# Altium schematic sheet TLV62569.SchDoc
size A3; SheetNumber: 6; SheetTotal: 7
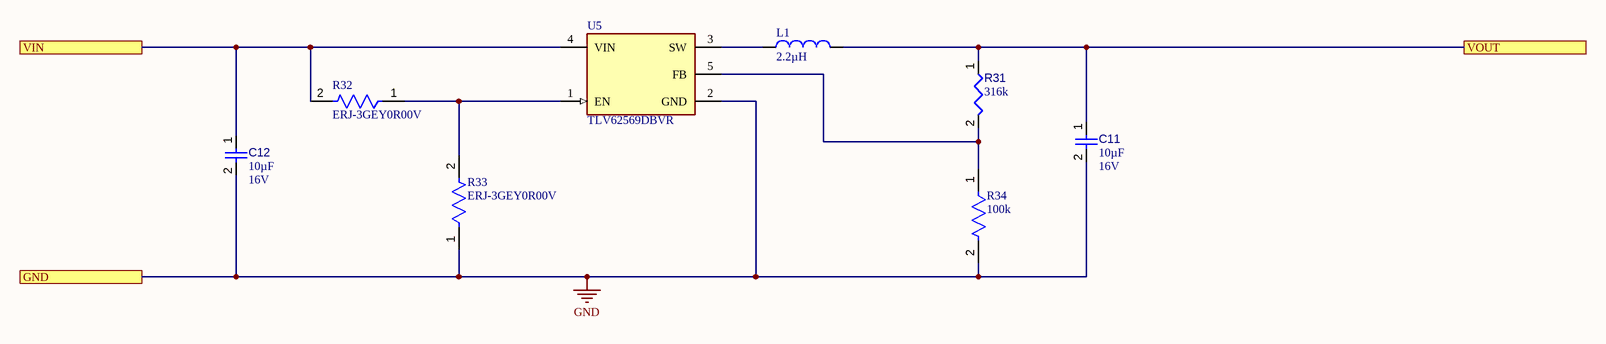
[diagram p0: TLV62569.SchDoc]

## Parts
C11  value 10µF  Voltage Rating: 16V  [CAPC1608X09N]  (hidden comment: CL10A106MO8NQNC)
C12  value 10µF  Voltage Rating: 16V  [CAPC1608X09N]  (hidden comment: CL10A106MO8NQNC)
L1  value 2.2µH  [INDC5050X40N]  (hidden comment: CMLW5040S2R2MST)
R31  value 316k  [RESC0402(1005)_L]  (hidden comment: Resistor 316K +/-1 % 0402 63 mW)
R32  ERJ-3GEY0R00V  [FP-ERJ-3GEY0R00V-MFG]
R33  ERJ-3GEY0R00V  [FP-ERJ-3GEY0R00V-MFG]
R34  Resistance: 100k  [FP-CRCW0402-e3-IPC_C]  (hidden comment: CRCW0402100KFKED)
U5  TLV62569DBVR  [FP-DBV0005A-IPC_B]

## Ports
GND, VIN, VOUT

## Nets
GND: C11.2 C12.2 R33.1 R34.2 U5.2(GND) ; port GND
VIN: C12.1 R32.2 U5.4(VIN) ; port VIN
VOUT: C11.1 L1.2 R31.1 ; port VOUT
NetL1_1: L1.1 U5.3(SW)
NetR31_2: R31.2 R34.1 U5.5(FB)
NetR32_1: R32.1 R33.2 U5.1(EN)

## Notes on the sheet
- Sheet Title
- PCB Project Name
- Modified
- Sheet
- of

## Library data of the parts
C11 C12 = CMP-001-00088-2: Ceramic Capacitor, Multilayer, Ceramic, 16V, 20% +Tol, 20% -Tol, X5R, 15% TC, 10uF, Surface Mount, 0603; Manufacturer 1: Samsung; Manufacturer Lifecycle 1: Unknown; RoHS Compliant: Yes; Min Operating Temperature: -55°C; Manufacturer Part Number 1: CL10A106MO8NQNC; Case/Package: 0603; Supplier 1: LCSC; Supplier Unit Price 1: .007; Capacitor Type: Ceramic; Supplier Part Number 1: C92487; Max Operating Temperature: 85°C; Pins: 2; Mounting Technology: Surface Mount
L1 = CMP-006-00022-1: Shielded wirewound inductor, 2.2uH, 20%, 3.95A, 17 mohm DCR; Manufacturer 1: Cybermax; Manufacturer Lifecycle 1: Unknown; Supplier Part Number 1: CMLW5040S2R2MST; Case/Package: SMD; Supplier Unit Price 1: .034; Min Operating Temperature: 125°C; Pins: 2; Supplier 1: LCSC; Tolerance: 20%; Manufacturer Part Number 1: CMLW5040S2R2MST; Max Operating Temperature: -40°C
R31 = CMP-009-00142-2: Chip Resistor, 316 kOhms, +/-1 %, 63 mW, -55 to 155 degC, 0402; Power: 63mW; Tolerance: 1%; Max Operating Temperature: 155°C; Pins: 2; Min Operating Temperature: -55°C; Case/Package: 0402
R32 R33 = CMP-2000-00700-2: RES SMD 0 OHM JUMPER 1/10W 0603; Manufacturer: Panasonic; Tolerance: 5%; Description: 0 Ohms Jumper 0.1W, 1/10W Chip Resistor 0603 (1608 Metric) Automotive AEC-Q200 Thick Film; Automotive Grade: Grade 0; Voltage Rating: 75V; Value: 0Ω; Temperature Coefficient: -100/+600ppm/°C; Power Rating: 0.1W; Mouser Description: Resistor, Chip Thick Film, 0 Ohm, 0.1w, Resistor, Chip Thick Film, 0 Ohm, 0.1w, 5%; Manufacturer Part Number: ERJ-3GEY0R00V; Ipc Land Pattern Name: RESC16080X45; Category: Res; Package: 0603; Temperature: -55°C to +155°C; Temperature Range Low: -55°C; Series: ERJ; Resistance: 0Ω; RoHS: TRUE; Composition: Thick Film; Octopart: https://octopart.com/erj-3gey0r00v-panasonic-55389238; Device Class L1: Passive Components; Footprint Url: https://industrial.panasonic.com/cdbs/www-data/pdf/RDA0000/DMA0000COL17.pdf; ComponentLink2Description: Datasheet; Device Class L2: Resistors; Temperature Range High: +155°C; Digikey Description: RES SMD 0 OHM JUMPER 1/10W 0603; Lead Free: Yes; Device Class L3: Chip SMD Resistors; Height: 0.55mm; ComponentLink2URL: https://industrial.panasonic.com/cdbs/www-data/pdf/RDA0000/AOA0000C301.pdf; Automotive: Yes
R34 = CMP-2002-08123-3: RES Thick Film, 100kΩ, 1%, 0.063W, 100ppm/°C, 0402; Power Rating: 63mW; Voltage Rating (DC): 50V; Lead Free: Lead Free; Height: 0.35mm; Contact Plating: Tin; Min Operating Temperature: -55°C; Package Quantity: 10000; Case/Package: 0402; Temperature Coefficient: 100ppm/°C; Number of Terminations: 2; Packaging: Tape and Reel; Max Power Dissipation: 63mW; Case Code (Metric): 1005; Mount: Surface Mount; Width: 0.02inch; Termination: SMD/SMT; Length: 1mm; Number of Pins: 2; Weight: 2.3E-05oz; Radiation Hardening: No; Tolerance: 1%; Military Standard: Not; Features: Automotive AEC-Q200; Depth: 0.5mm; Composition: Thick Film; Max Operating Temperature: 155°C; Voltage Rating: 50V; Case Code (Imperial): 0402
U5 = CMP-019-00051-1: Switching Regulator, 2A, 1500kHz Switching Freq-Max, PDSO5; Max Supply Voltage: 5.5V; Max Operating Temperature: 125°C; Min Operating Temperature: -40°C; RoHS Compliant: Yes; Case/Package: LSSOP; Pins: 5